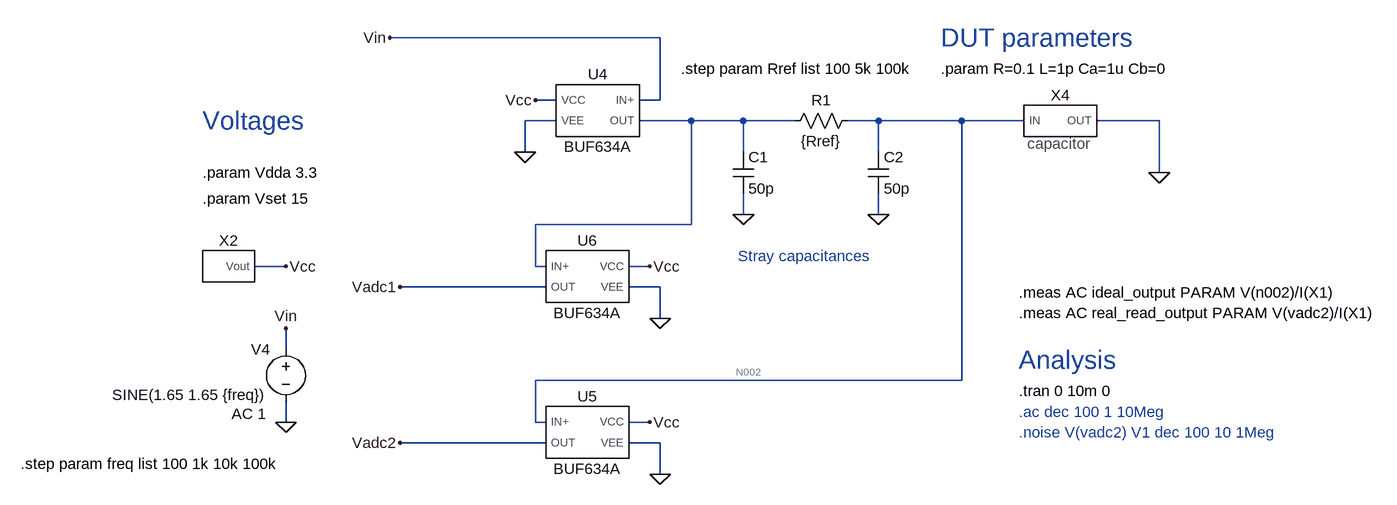
[diagram p0: schematic IV_real.asc]
IV_real.asc, the LTspice schematic file:
Version 4
SHEET 1 1780 992
WIRE 128 160 -288 160
WIRE -32 256 -64 256
WIRE 128 256 128 160
WIRE 128 256 96 256
WIRE -32 288 -80 288
WIRE 176 288 96 288
WIRE 256 288 176 288
WIRE 336 288 256 288
WIRE 464 288 416 288
WIRE 592 288 464 288
WIRE 688 288 592 288
WIRE 896 288 800 288
WIRE -80 336 -80 288
WIRE 256 336 256 288
WIRE 464 336 464 288
WIRE 896 368 896 288
WIRE 256 432 256 400
WIRE 464 432 464 400
WIRE 176 448 176 288
WIRE 176 448 -64 448
WIRE -448 512 -496 512
WIRE -64 512 -64 448
WIRE -48 512 -64 512
WIRE 112 512 80 512
WIRE -48 544 -272 544
WIRE 128 544 80 544
WIRE 128 592 128 544
WIRE -448 640 -448 608
WIRE 592 688 592 288
WIRE 592 688 -64 688
WIRE -448 752 -448 720
WIRE -64 752 -64 688
WIRE -48 752 -64 752
WIRE 112 752 80 752
WIRE -48 784 -272 784
WIRE 128 784 80 784
WIRE 128 832 128 784
FLAG -80 336 0
FLAG -64 256 Vcc
FLAG -288 160 Vin
FLAG 896 368 0
FLAG -272 544 Vadc1
FLAG -272 784 Vadc2
FLAG -448 512 Vcc
FLAG -448 752 0
FLAG -448 608 Vin
FLAG 112 512 Vcc
FLAG 112 752 Vcc
FLAG 128 592 0
FLAG 128 832 0
FLAG 256 432 0
FLAG 464 432 0
SYMBOL res 432 272 R90
WINDOW 0 0 56 VBottom 2
WINDOW 3 32 56 VTop 2
SYMATTR InstName R1
SYMATTR Value {Rref}
SYMBOL voltage -448 624 M0
WINDOW 123 30 115 Left 2
WINDOW 39 0 0 Left 0
WINDOW 3 29 86 Left 2
SYMATTR Value2 AC 1
SYMATTR Value SINE(1.65 1.65 {freq})
SYMATTR InstName V4
SYMBOL powersupply -544 512 R0
SYMATTR InstName X2
SYMBOL BUF634A 32 272 M0
SYMATTR InstName U4
SYMBOL capacitor 736 288 R0
SYMATTR InstName X4
SYMBOL BUF634A 16 768 R0
SYMATTR InstName U5
SYMBOL BUF634A 16 528 R0
SYMATTR InstName U6
SYMBOL cap 240 336 R0
SYMATTR InstName C1
SYMATTR Value 50p
SYMBOL cap 448 336 R0
SYMATTR InstName C2
SYMATTR Value 50p
TEXT 680 704 Left 2 !.tran 0 10m 0
TEXT 680 736 Left 2 ;.ac dec 100 1 10Meg
TEXT 560 208 Left 2 !.param R=0.1 L=1p Ca=1u Cb=0
TEXT 680 768 Left 2 ;.noise V(vadc2) V1 dec 100 10 1Meg
TEXT 680 656 Left 4 ;Analysis
TEXT -576 288 Left 4 ;Voltages
TEXT 680 552 Left 2 !.meas AC ideal_output PARAM V(n002)/I(X1)
TEXT 160 208 Left 2 !.step param Rref list 100 5k 100k
TEXT 680 584 Left 2 !.meas AC real_read_output PARAM V(vadc2)/I(X1)
TEXT 560 160 Left 4 ;DUT parameters
TEXT -576 368 Left 2 !.param Vdda 3.3
TEXT -576 408 Left 2 !.param Vset 15
TEXT 248 496 Left 2 ;Stray capacitances
TEXT -856 816 Left 2 !.step param freq list 100 1k 10k 100k

The netlist it stands for:
* IV_real.asc
R1 N002 N001 {Rref}
V4 Vin 0 SINE(1.65 1.65 {freq}) AC 1
XX2 Vcc powersupply  ; pins Vout
XU4 Vin N001 Vcc 0 BUF634A  ; pins IN+ OUT VCC VEE
XX4 N002 0 capacitor  ; pins IN OUT
XU5 N002 Vadc2 Vcc 0 BUF634A  ; pins IN+ OUT VCC VEE
XU6 N001 Vadc1 Vcc 0 BUF634A  ; pins IN+ OUT VCC VEE
C1 N001 0 50p
C2 N002 0 50p
.tran 0 10m 0
* .ac dec 100 1 10Meg
.param R=0.1 L=1p Ca=1u Cb=0
* .noise V(vadc2) V1 dec 100 10 1Meg
* Analysis
* Voltages
.meas AC ideal_output PARAM V(n002)/I(X1)
.step param Rref list 100 5k 100k
.meas AC real_read_output PARAM V(vadc2)/I(X1)
* DUT parameters
.param Vdda 3.3
.param Vset 15
* Stray capacitances
.step param freq list 100 1k 10k 100k
.lib C:\Users\rolando\OneDrive - Imperial College London\EE3\Instrumentation\Coursework 2\complex_Z_meter\spice_sim\models\buf634a_a.lib
.backanno
.end